# Altium schematic sheet sumador_analogico.SchDoc
size A4
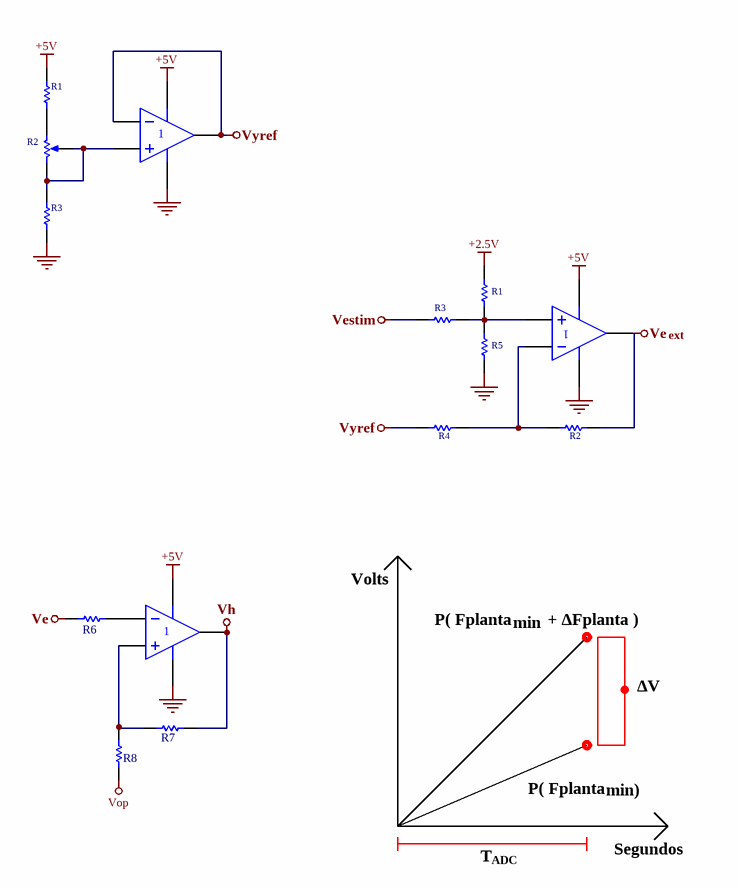
[diagram p0: sumador_analogico.SchDoc]

## Parts
(Parts that share a designator on the sheet are numbered #1, #2 ... from top to bottom, then left to right.)
R1#1  316  [R1206]  (value not drawn)
R1#2  1k  [R1206]  (value not drawn)
R2#1  RPot  [BOR3]  (value not drawn)
R2#2  1k  [R1206]  (value not drawn)
R3#1  4k99  [R1206]  (value not drawn)
R3#2  1k  [R1206]  (value not drawn)
R4  1k  [R1206]  (value not drawn)
R5  1k  [R1206]  (value not drawn)
R?#1  R6  [AXIAL-0.3]
R?#2  R8  [AXIAL-0.3]
R?#3  R7  [AXIAL-0.3]
U300  MCP664  [SOIC14]  (value not drawn)  (part A of 4)
U?#1  MCP664  [SOIC14]  (value not drawn)  (part A of 4)
U?#2  MCP664  [SOIC14]  (value not drawn)  (part A of 4)

## Harnesses
*: 

## Nets
+2.5V: R1#2.2
+5V: R1#1.2 U300.11(V-) U?#1.4(V+) U?#2.4(V+)
GND: R3#1.1 R5.1 U300.4(V+) U?#1.11(V-) U?#2.11(V-)
Ve: R2#2.2 R?#1.1
Vestim: R3#2.1
Vh: R?#3.1 U?#2.1(OUT)
Vop: R?#2.2
Vyref: R4.1 U?#1.1(OUT) U?#1.2(IN-)
NetR1#1_1: R1#1.1 R2#1.1(TOP)
NetR1#2_1: R1#2.1 R3#2.2 R5.2 U300.3(IN+)
NetR2#1_2: R2#1.2(TAP) R2#1.3(BOT) R3#1.2 U?#1.3(IN+)
NetR2#2_1: R2#2.1 R4.2 U300.2(IN-)
NetR?#1_2: R?#1.2 U?#2.2(IN-)
NetR?#2_1: R?#2.1 R?#3.2 U?#2.3(IN+)

Not connected (* = marked no-connect by the designer): U300 1(OUT)

## Notes on the sheet
- Volts
- P( Fplanta        + ΔFplanta )
- min
- ΔV
- P( Fplanta
- min)
- Segundos
- T
- ADC
- Labels drawn without touching a wire or pin: ext

## Library data of the parts
R1#1 R3#1 = R1206: Resistor Chip; 1/8W;; Published: 8-Jun-2000; LatestRevisionDate: 26/8/2013; PackageReference: 1206; Publisher: Altium Limited; PackageDescription: SMT Chip Resistor; Supplier 1: Digi-Key
  R1#1: Value: 316
  R3#1: Value: 4k99
R1#2 R2#2 R3#2 R4 R5 = R1206: RES 1K OHM 1% 1/4W 1206; Manufacturer: Stackpole Electronics Inc; Mfr PN: RMCF1206FT1K00; Supplier 1: Digi-Key; Value: 1k; Tolerance: 1%; Supplier 1 PN: RMCF1206FT1K00CT-ND
  R1#2: PackageReference: 1206; PackageDescription: SMT Chip Resistor
  R2#2 R3#2 R5: PackageReference: 1206
R2#1 = RPot: Potentiometer; Sim Note: Enter the Resistance value and the set point into parameter fields.; Set Position: 0.5; Value: 1k; Published: 8-Jun-2000; LatestRevisionDate: 17-Jul-2002; LatestRevisionNote: Re-released for DXP Platform.; PackageReference: VR5; Publisher: Altium Limited
R?#1-R?#3 = Res1: Resistor; Value: 1K; Published: 8-Jun-2000; LatestRevisionDate: 17-Jul-2002; LatestRevisionNote: Re-released for DXP Platform.; PackageReference: AXIAL-0.3; Publisher: Altium Limited; PackageDescription: Axial Device, Thru-Hole; 2 Leads; 0.3 in Pin Spacing
U300 = MCP664: IC OPAMP GP 4 CIRCUIT 14TSSOP; Mfr PN: MCP664-E/ST; Manufacturer: Microchip Technology; Datasheet: https://ar.mouser.com/datasheet/2/268/20002194E-2448650.pdf; Supplier 1 PN: MCP664-E/ST-ND; Supplier 1: Digi-Key
U?#1 U?#2 = MCP664: Part Number: MCP664-E/ST; Datasheet: https://ar.mouser.com/datasheet/2/268/20002194E-2448650.pdf